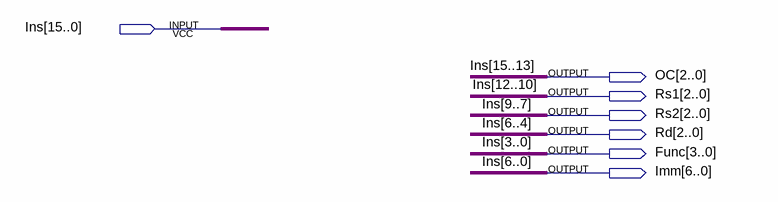
[diagram p0: schematic sheet]
// Quartus schematic Instruction_Fetch_Design.bdf as structural Verilog: 0 symbols, 7 pins
module Instruction_Fetch_Design (
  input  [15:0] Ins,
  output [2:0] OC,
  output [2:0] Rs1,
  output [2:0] Rs2,
  output [2:0] Rd,
  output [3:0] Func,
  output [6:0] Imm
);


  assign Func = Ins[3:0];
  assign Imm = Ins[6:0];
  assign OC = Ins[15:13];
  assign Rd = Ins[6:4];
  assign Rs1 = Ins[12:10];
  assign Rs2 = Ins[9:7];
endmodule
